# EAGLE design dGPS_mainBoard (EAGLE 8.1.1)
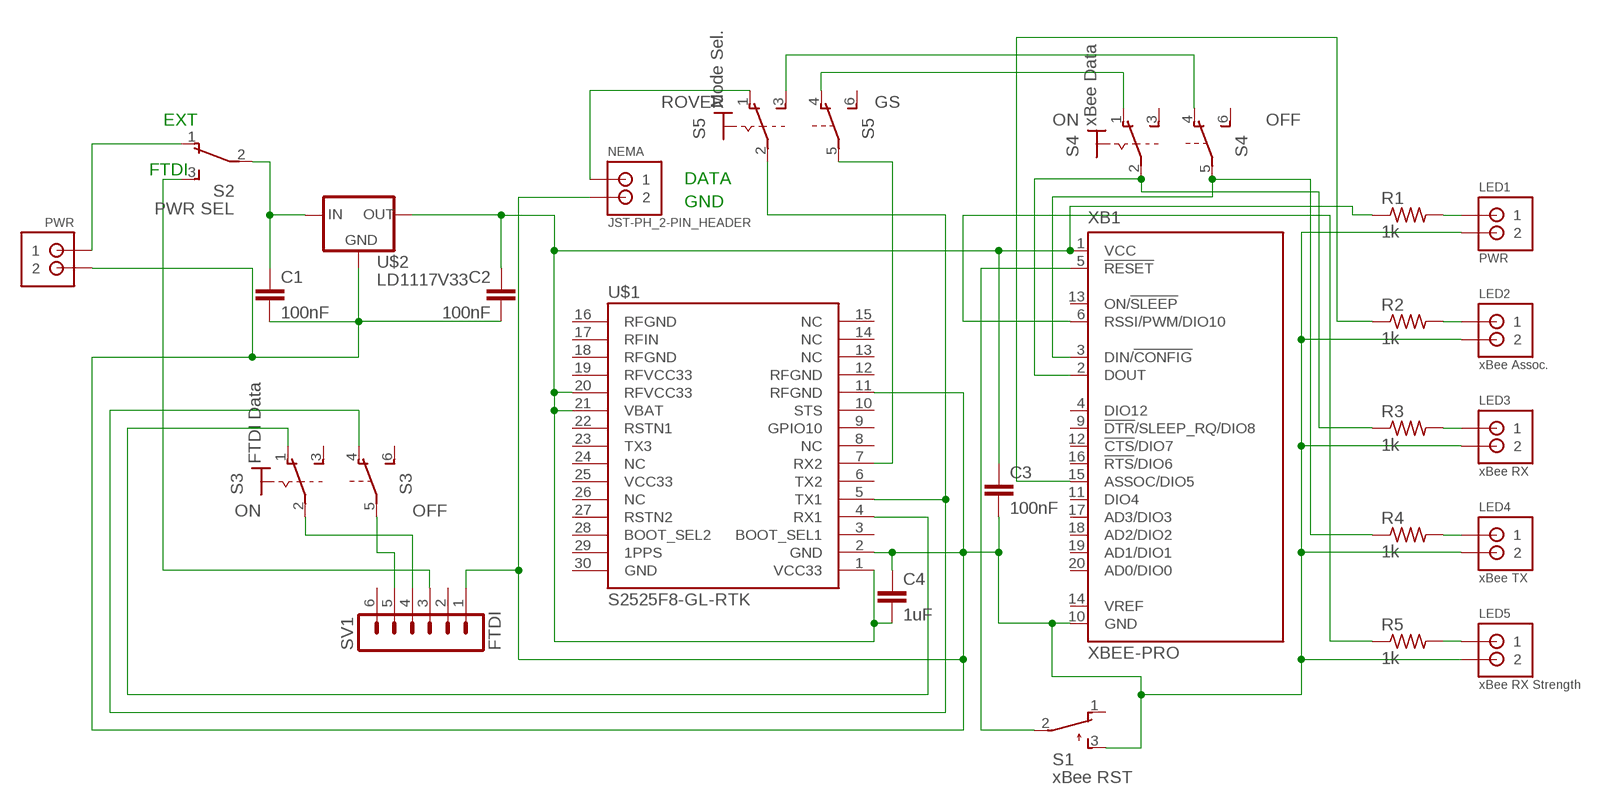
[diagram p0: schematic, sheet 1]

## Parts
C1  100nF  C2.5/5  [C2.5-5]
C2  100nF  C2.5/5  [C2.5-5]
C3  100nF  C2.5/5  [C2.5-5]
C4  1uF  C2.5/5  [C2.5-5]
LED1  PWR  JST-PH_2-PIN_HEADER  [JST_B2B-PH_HEADER]
LED2  xBee Assoc.  JST-PH_2-PIN_HEADER  [JST_B2B-PH_HEADER]
LED3  xBee RX  JST-PH_2-PIN_HEADER  [JST_B2B-PH_HEADER]
LED4  xBee TX  JST-PH_2-PIN_HEADER  [JST_B2B-PH_HEADER]
LED5  xBee RX Strength  JST-PH_2-PIN_HEADER  [JST_B2B-PH_HEADER]
NEMA  JST-PH_2-PIN_HEADER  [JST_B2B-PH_HEADER]
PWR  JST-PH_2-PIN_HEADER  [JST_B2B-PH_HEADER]
R1  1k  R-US_0204/5  [0204/5]
R2  1k  R-US_0204/5  [0204/5]
R3  1k  R-US_0204/5  [0204/5]
R4  1k  R-US_0204/5  [0204/5]
R5  1k  R-US_0204/5  [0204/5]
S1  xBee RST  TL32YO  [TL3XYO]
S2  PWR SEL  TL36PO  [TL3XPO]
S3  FTDI Data  320-938  [320-938]
S4  xBee Data  320-938  [320-938]
S5  Mode Sel.  320-938  [320-938]
SV1  FTDI  MA06-1  [MA06-1]
U$1  S2525F8‐GL‐RTK  [NS-HP-GL2]
U$2  LD1117V33  [LD1117V33]
XB1  XBEE-PRO  [XBEE-PRO]

## Nets
N$1: C2.1 C3.1 C4.2 R1.1 U$1.1(VCC33) U$1.20(RFVCC33) U$1.21(VBAT) U$2.OUT XB1.1(VCC)
N$2: S3.5(B:P) SV1.5
N$3: S5.5(B:P) U$1.7(RX2)
N$4: S3.1(1:O) U$1.4(RX1)
N$5: S4.1(1:O) S5.4(B:O)
N$6: S4.4(B:O) S5.3(1:S)
N$7: NEMA.P1 S5.1(1:O)
N$8: S3.2(1:P) SV1.4
N$9: S3.4(B:O) S5.2(1:P) U$1.5(TX1)
N$10: R4.1 S4.5(B:P) XB1.3(DIN/!CONFIG)
N$11: R3.1 S4.2(1:P) XB1.2(DOUT)
N$12: R2.1 XB1.15(ASSOC/DIO5)
N$13: S1.2(P) XB1.5(!RESET)
N$14: PWR.P1 S2.1(O)
N$15: C1.1 S2.2(P) U$2.IN
N$16: S2.3(S) SV1.3
N$17: C1.2 C2.2 C3.2 C4.1 LED1.P2 LED2.P2 LED3.P2 LED4.P2 LED5.P2 NEMA.P2 PWR.P2 S1.3(S) SV1.1 U$1.2(GND) U$1.11(RFGND) U$2.GND XB1.10(GND)
N$18: R5.1 XB1.6(RSSI/PWM/DIO10)
N$19: LED1.P1 R1.2
N$20: LED2.P1 R2.2
N$21: LED3.P1 R3.2
N$22: LED4.P1 R4.2
N$23: LED5.P1 R5.2
Unconnected: S1.1(O) S3.3(1:S) S3.6(B:S) S4.3(1:S) S4.6(B:S) S5.6(B:S) SV1.2 SV1.6 U$1.3(BOOT_SEL1) U$1.6(TX2) U$1.8(NC) U$1.9(GPIO10) U$1.10(STS) U$1.12(RFGND) U$1.13(NC) U$1.14(NC) U$1.15(NC) U$1.16(RFGND) U$1.17(RFIN) U$1.18(RFGND) U$1.19(RFVCC33) U$1.22(RSTN1) U$1.23(TX3) U$1.24(NC) U$1.25(VCC33) U$1.26(NC) U$1.27(RSTN2) U$1.28(BOOT_SEL2) U$1.29(1PPS) U$1.30(GND) XB1.4(DIO12) XB1.9(!DTR!/SLEEP_RQ/DIO8) XB1.11(DIO4) XB1.12(!CTS!/DIO7) XB1.13(ON/!SLEEP) XB1.14(VREF) XB1.16(!RTS!/DIO6) XB1.17(AD3/DIO3) XB1.18(AD2/DIO2) XB1.19(AD1/DIO1) XB1.20(AD0/DIO0)

## Notes on the sheet
- ROVER | GS
- EXT | ON | OFF
- FTDI
- DATA
- GND
- ON | OFF

## Library data of the parts
C1-C4 = capacitor-wima:C: CAPACITOR naming: grid - package width
LED1-LED5 NEMA PWR = SRG:JST-PH_2-PIN_HEADER: 2-pin JST PH Shrouded Header, top entry P/N B2B-PH-K-S Mating connector PHR-2 Mating cable assembly: Sparkfun PRT-09914 <http://www.sparkfun.com/products/9914>
R1-R5 = rcl:R-US_: RESISTOR, American symbol
S1 = switch:TL32YO: TINY SWITCH ON - MOM Source: http://www2.produktinfo.conrad.com/datenblaetter/700000-724999/705152-da-01-de-Subminiaturschalter_TL_36YO.pdf
S2 = switch:TL36PO: TINY SWITCH ON - ON Source: http://www2.produktinfo.conrad.com/datenblaetter/700000-724999/705152-da-01-de-Subminiaturschalter_TL_36YO.pdf
S3-S5 = switch:320-938: TOGGLE SWITCH distributor RS Components
SV1 = con-lstb:MA06-1: PIN HEADER; OC_FARNELL: unknown; OC_NEWARK: unknown
U$1 = skytraq:S2525F8‐GL‐RTK
U$2 = LD1117V33:LD1117V33
XB1 = xbee:XBEE: XBee (TM) /XBee-PRO(TM) OEM RF Modules Source: MaxStream, Inc. xbee_productmanual.pdf; MPN: XBP24-AWI-001; OC_FARNELL: 1337916; OC_NEWARK: 42M2667

## Board
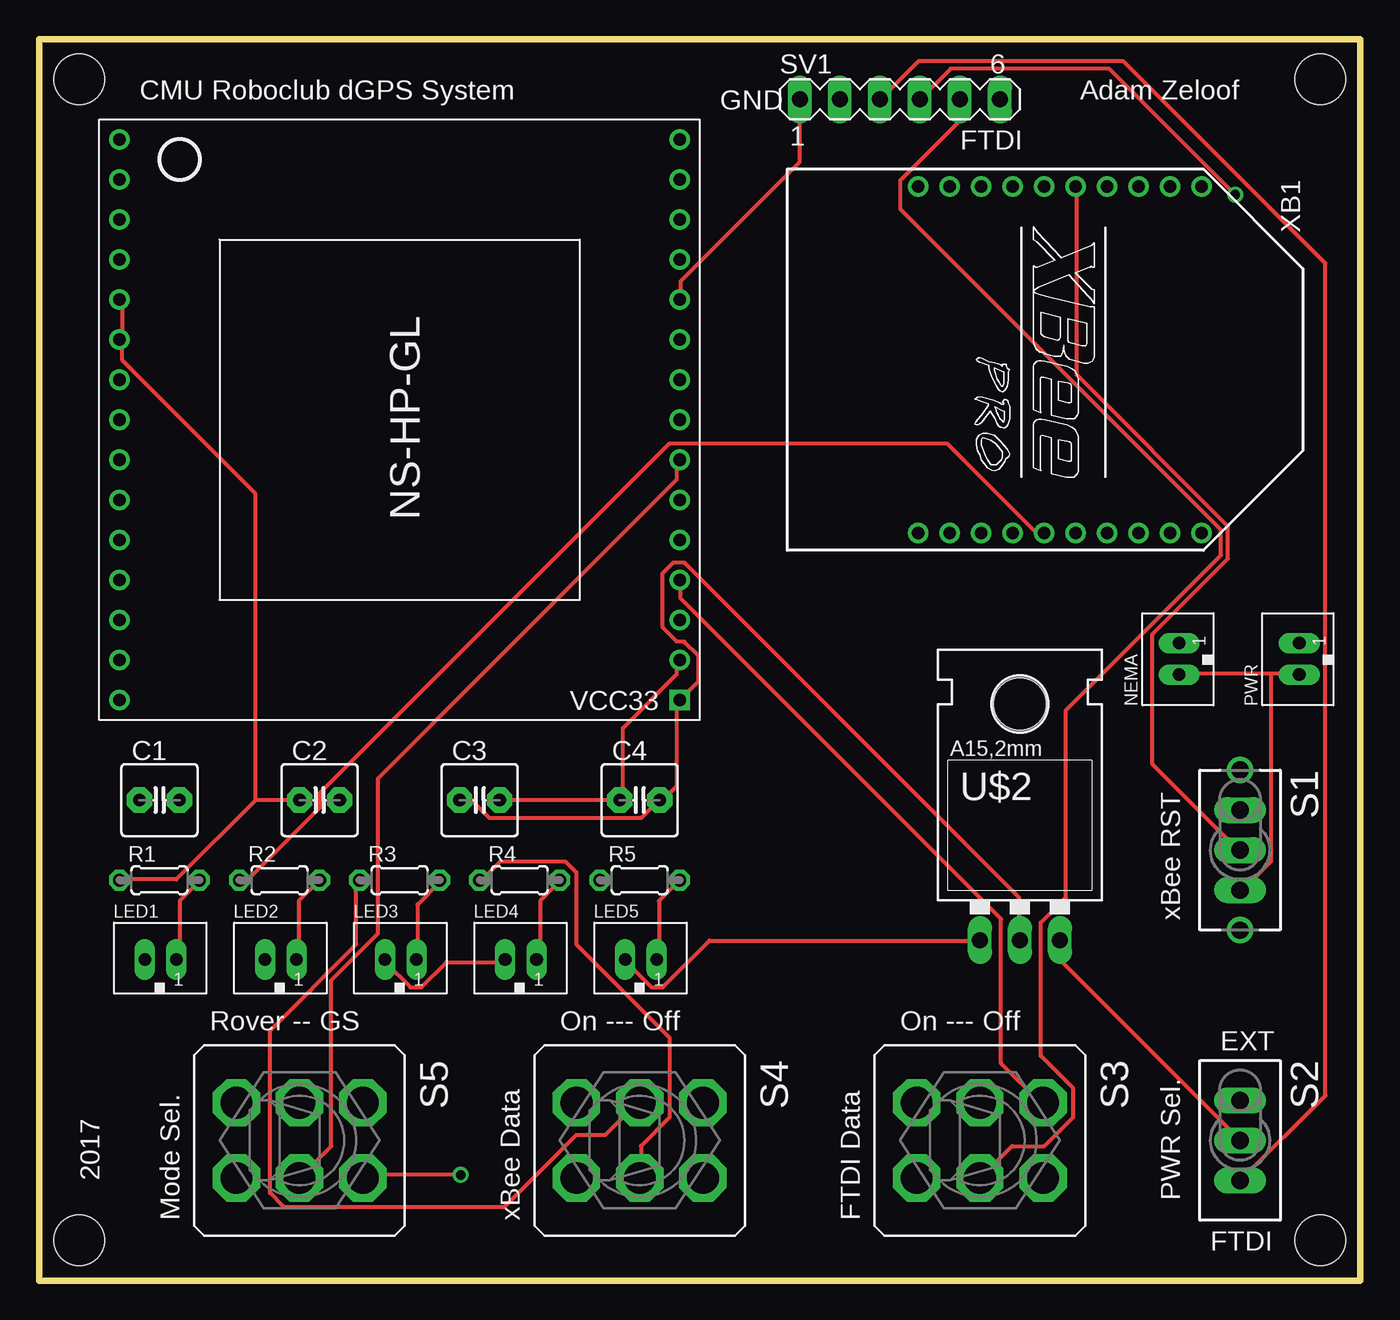
[diagram p1: board, top side]
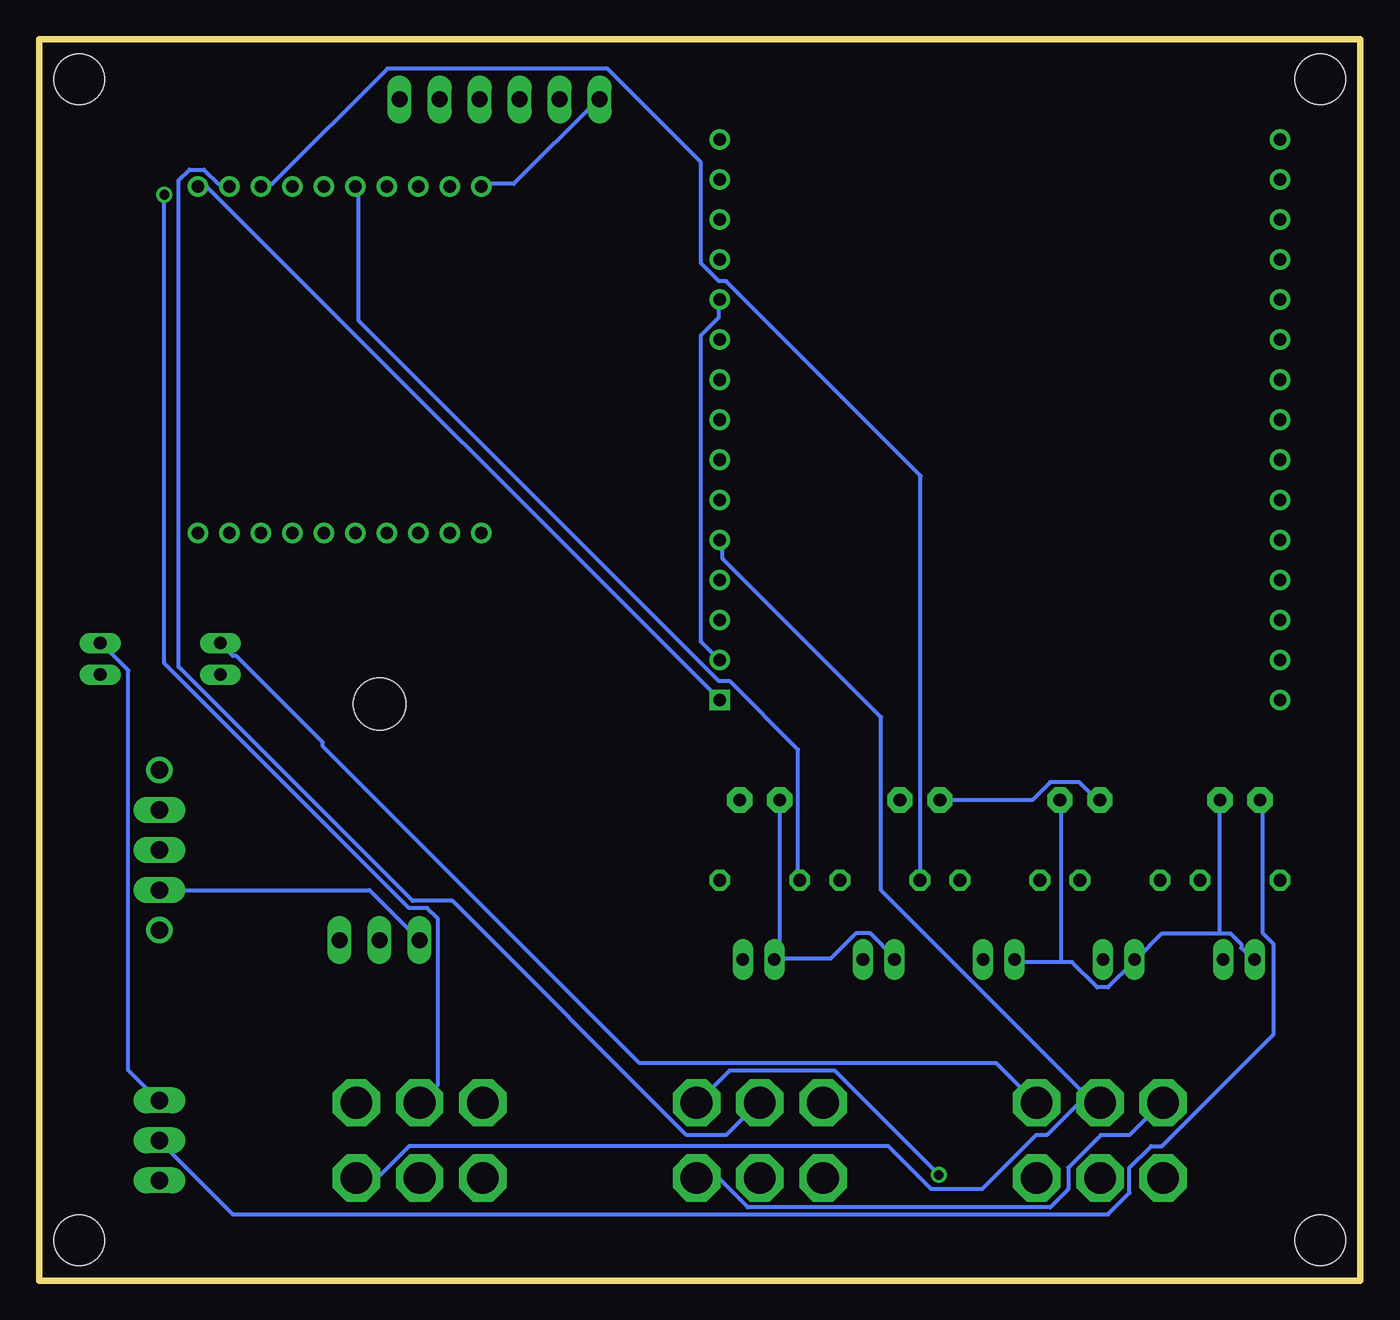
[diagram p2: board, bottom side, seen from below]

Size 83.82 x 78.74 mm. Coordinates in mm from the lower left corner, seen from the top.
Outline: 0,78.74 0,0 83.82,0 83.82,78.74 0,78.74
Copper layers (1*16): Top 0.035mm / dielectric 1.5mm / Bottom 0.035mm
Design rules "default": minimum track width 10mil, minimum drill 24mil, track to track 8mil, track to pad 8mil, pad to pad 8mil, via to via 8mil, smd to smd 8mil, copper to edge 40mil, drill to drill 8mil, minimum pad ring 10mil, minimum via ring 8mil, stop-mask expansion 4mil, vias tented up to drill 0mil, thermal gap 10mil
Holes 3.2 mm at 2.54,76.2 81.28,76.2 2.54,2.54 81.28,2.54

### Footprints (pad centres in the part's own frame; a part is rotated, then mirrored left to right if it is on the bottom)
C2.5-5 = drill 0.813 pad 1.6 octagon: 1 -1.27,0; 2 1.27,0
JST_B2B-PH_HEADER = drill 0.8 long: P1 1.075,0.048; P2 -0.925,0.048
0204/5 = drill 0.813 octagon: 1 -2.54,0; 2 2.54,0
TL3XYO = drill 1.1 pad 1.422 long: 1 -2.54,0; 2 0,0; 3 2.54,0 | drill 1.1 pad 1.676: M1 -5.08,0; M2 5.08,0
TL3XPO = drill 1.1 pad 1.422 long: 1 -2.54,0; 2 0,0; 3 2.54,0
320-938 = drill 2.007 octagon: 1 -2.388,4.013; 2 -2.388,0; 3 -2.388,-4.013; 4 2.388,4.013; 5 2.388,0; 6 2.388,-4.013
MA06-1 = drill 1.016 long: 1 -6.35,0; 2 -3.81,0; 3 -1.27,0; 4 1.27,0; 5 3.81,0; 6 6.35,0
NS-HP-GL2 = drill 0.8 square: 1 -1.27,1.27 | drill 0.8: 2 -1.27,3.81; 3 -1.27,6.35; 4 -1.27,8.89; 5 -1.27,11.43; 6 -1.27,13.97; 7 -1.27,16.51; 8 -1.27,19.05; 9 -1.27,21.59; 10 -1.27,24.13; 11 -1.27,26.67; 12 -1.27,29.21; 13 -1.27,31.75; 14 -1.27,34.29; 15 -1.27,36.83; 16 -36.83,36.83; 17 -36.83,34.29; 18 -36.83,31.75; 19 -36.83,29.21; 20 -36.83,26.67; 21 -36.83,24.13; 22 -36.83,21.59; 23 -36.83,19.05; 24 -36.83,16.51; 25 -36.83,13.97; 26 -36.83,11.43; 27 -36.83,8.89; 28 -36.83,6.35; 29 -36.83,3.81; 30 -36.83,1.27
LD1117V33 = drill 1.016 long: GND -2.54,-8.89; IN 2.54,-8.89; OUT 0,-8.89 | hole 3.302: 0,6.096
XBEE-PRO = drill 0.8 pad 1.27: 1 -11,9; 2 -11,7; 3 -11,5; 4 -11,3; 5 -11,1; 6 -11,-1; 7 -11,-3; 8 -11,-5; 9 -11,-7; 10 -11,-9; 11 11,-9; 12 11,-7; 13 11,-5; 14 11,-3; 15 11,-1; 16 11,1; 17 11,3; 18 11,5; 19 11,7; 20 11,9

### Placement (x,y rotation side)
C1  7.62,30.48 0 top
C2  17.78,30.48 0 top
C3  27.94,30.48 0 top
C4  38.1,30.48 0 top
LED1  7.62,20.32 0 top
LED2  15.24,20.32 0 top
LED3  22.86,20.32 0 top
LED4  30.48,20.32 0 top
LED5  38.1,20.32 0 top
NEMA  72.39,39.37 90 top
PWR  80.01,39.37 90 top
R1  7.62,25.4 0 top
R2  15.24,25.4 0 top
R3  22.86,25.4 0 top
R4  30.48,25.4 0 top
R5  38.1,25.4 0 top
S1  76.2,27.3 270 top
S2  76.2,8.89 270 top
S3  59.69,8.89 270 top
S4  38.1,8.89 270 top
S5  16.51,8.89 270 top
SV1  54.61,74.93 0 top
U$1  41.91,35.56 0 top
U$2  62.23,30.48 0 top
XB1  64.77,58.42 270 top

### Tracks (layer width: path | path; a pad name or v marks a point on that pad's centre or on a via)
N$1
  Top 0.254: U$1.20 5.26,62.03 5.26,59.74 U$1.21 5.26,59.51 5.26,58.37 13.72,49.91 13.72,30.48 | 13.72,30.48 8.69,25.45 5.26,25.45 R1.1 | C2.1 13.72,30.48 | U$2.OUT 62.18,21.79 62.18,24.31 40.92,45.57 40.23,45.57 39.55,44.88 39.55,41.45 40.46,40.54 40.92,40.54 41.83,39.62 41.83,38.02 U$1.1 40.46,36.65 40.46,31.39 39.55,30.48 C4.2 39.32,30.48 38.18,29.34 28.58,29.34 27.43,30.48 C3.1
  Bottom 0.254: C3.1 20.8,30.48 19.66,31.62 17.83,31.62 16.69,30.48 C2.1 | U$1.1 73.15,69.34 73.61,69.34 XB1.1
N$2
  Top 0.254: S3.5 61.72,8.53 63.78,8.53 65.61,10.36 65.61,12.19 63.55,14.25 63.55,22.71 65.15,24.31 65.15,36.2 74.98,46.02 74.98,47.62 54.64,67.97 54.64,69.8 58.29,73.46 58.29,74.83 SV1.5
N$3
  Top 0.254: U$1.7 40.46,51.97 40.46,50.82 21.49,31.85 21.49,22.02 18.52,19.05 18.52,8.53 16.69,6.71 S5.5
N$4
  Top 0.254: U$1.4 40.69,44.42 40.69,43.28 61.04,22.94 61.04,13.79 63.55,11.28 S3.1
N$5  (via drill 0.61)
  Top 0.254: v26.75,6.71 20.57,6.71 S5.4
  Bottom 0.254: v26.75,6.71 33.38,13.33 40.01,13.33 42.06,11.28 S4.1
N$6
  Bottom 0.254: S4.4 42.06,6.48 40.69,6.48 38.86,4.65 19.66,4.65 18.52,5.79 18.52,7.16 16.46,9.22 14.63,9.22 12.57,11.28 S5.3
N$7
  Bottom 0.254: NEMA.P1 72.24,40.31 71.55,39.62 71.32,39.62 65.84,34.14 65.84,33.91 45.72,13.79 23.09,13.79 20.57,11.28 S5.1
N$8  (via drill 0.61)
  Top 0.254: SV1.4 57.84,76.89 67.89,76.89 v75.89,68.88
  Bottom 0.254: v75.89,68.88 75.89,39.17 60.35,23.62 59.21,23.62 58.52,22.94 58.52,12.42 59.67,11.28 S3.2
N$9
  Bottom 0.254: 17.37,11.73 16.92,11.28 S5.2 17.37,11.73 | 17.37,11.73 30.4,24.77 30.4,35.74 40.46,45.8 40.46,46.94 U$1.5 | 17.37,11.73 19.89,9.22 20.57,9.22 24,5.79 27.2,5.79 29.95,8.53 60.35,8.53 62.18,6.71 63.55,6.71 S3.4
N$10
  Top 0.254: S4.5 38.18,6.71 38.18,8.53 40.01,10.36 40.01,15.39 34.06,21.34 34.06,25.91 33.38,26.59 29.26,26.59 28.12,25.45 R4.1
  Bottom 0.254: XB1.3 69.72,69.57 69.04,69.57 61.72,76.89 47.78,76.89 41.83,70.94 41.83,64.54 40.69,63.4 40.23,63.4 27.89,51.05 27.89,25.45 R4.1
N$11
  Top 0.254: R3.1 20.12,25.22 20.12,21.34 14.63,15.85 14.63,5.56 15.55,4.65 29.49,4.65 34.06,9.22 35.89,9.22 37.95,11.28 S4.2
  Bottom 0.254: XB1.2 71.78,69.57 72.47,69.57 73.38,70.48 74.3,70.48 74.98,69.8 74.98,38.94 60.12,24.08 57.61,24.08 42.75,9.22 40.23,9.22 38.18,11.28 S4.2
N$12
  Top 0.254: XB1.15 63.55,47.62 63.09,47.62 57.61,53.11 40.01,53.11 17.83,30.94 17.83,30.02 13.26,25.45 12.8,25.45 R2.1
N$13
  Top 0.254: XB1.5 65.84,69.34 65.84,57.45 75.44,47.85 75.44,45.8 70.64,41 70.64,32.77 76.12,27.28 S1.2
N$14
  Bottom 0.254: PWR.P1 79.78,40.31 78.18,38.71 78.18,13.33 76.35,11.51 S2.1
N$15
  Top 0.254: U$2.IN 64.92,21.57 64.92,20.19 76.12,8.99 S2.2
  Bottom 0.254: C1.1 6.17,30.48 6.17,22.02 5.49,21.34 5.49,15.62 12.57,8.53 13.26,8.53 14.63,7.16 14.63,5.56 16,4.19 71.55,4.19 76.12,8.76 S2.2
N$16
  Top 0.254: SV1.3 53.49,75.06 55.78,77.34 68.81,77.34 81.61,64.54 81.61,11.73 76.35,6.48 S2.3
N$17
  Top 0.254: 78.18,38.48 79.78,38.48 PWR.P2 | 78.18,38.48 72.47,38.48 NEMA.P2 | 78.18,38.48 78.18,26.59 76.35,24.77 S1.3 | U$1.11 40.69,62.25 40.69,63.4 48.23,70.94 48.23,74.83 SV1.1 | U$1.2 40.46,39.17 40.46,38.48 37.03,35.05 37.03,30.48 C4.1 C3.2 | LED4.P2 29.49,20.19 25.83,20.19 24.23,18.59 23.55,18.59 21.95,20.19 LED3.P2 | U$2.GND 59.67,21.57 42.52,21.57 39.55,18.59 38.86,18.59 37.26,20.19 LED5.P2
  Bottom 0.254: U$2.GND 62.86,24.77 S1.3 | XB1.10 55.55,69.57 53.72,69.57 48.46,74.83 SV1.1 | 8.91,22.02 12.57,22.02 14.17,20.42 LED2.P2 14.4,20.19 16,18.59 16.69,18.59 18.29,20.19 18.97,20.19 | 8.91,22.02 8.23,22.02 7.54,21.34 7.54,21.11 6.86,20.42 LED1.P2 | 18.97,20.19 21.72,20.19 LED3.P2 | 36.8,20.42 33.6,20.42 32,22.02 31.09,22.02 29.49,20.42 LED4.P2 | 36.8,20.42 37.03,20.42 LED5.P2 36.8,20.42 | 8.91,22.02 8.91,30.48 C1.2 | 18.97,20.19 18.97,30.48 C2.2 | 36.8,20.42 36.8,30.48 C4.1 | U$1.11 40.69,62.03 40.69,61.11 41.83,59.97 41.83,40.54 40.69,39.39 U$1.2
N$18
  Bottom 0.254: XB1.6 63.55,69.34 63.55,60.88 40.69,38.02 40.01,38.02 35.66,33.68 35.66,25.45 R5.1
N$19
  Top 0.254: LED1.P1 8.91,20.42 8.91,24.08 10.06,25.22 R1.2
N$20
  Top 0.254: R2.2 16.46,24.08 16.46,20.42 LED2.P1
N$21
  Top 0.254: LED3.P1 24,20.42 24,23.85 25.38,25.22 R3.2
N$22
  Top 0.254: LED4.P1 31.77,20.42 31.77,24.08 32.92,25.22 R4.2
N$23
  Top 0.254: R5.2 39.32,24.08 39.32,20.42 LED5.P1

### Text on the board
tNames: CMU Roboclub dGPS System | Adam Zeloof | GND | FTDI | xBee RST | Rover -- GS | On --- Off | On --- Off | EXT | 2017 | PWR Sel. | Mode Sel. | xBee Data | FTDI Data | FTDI